# EAGLE schematic scHnRk_5 (EAGLE 7.5.0)
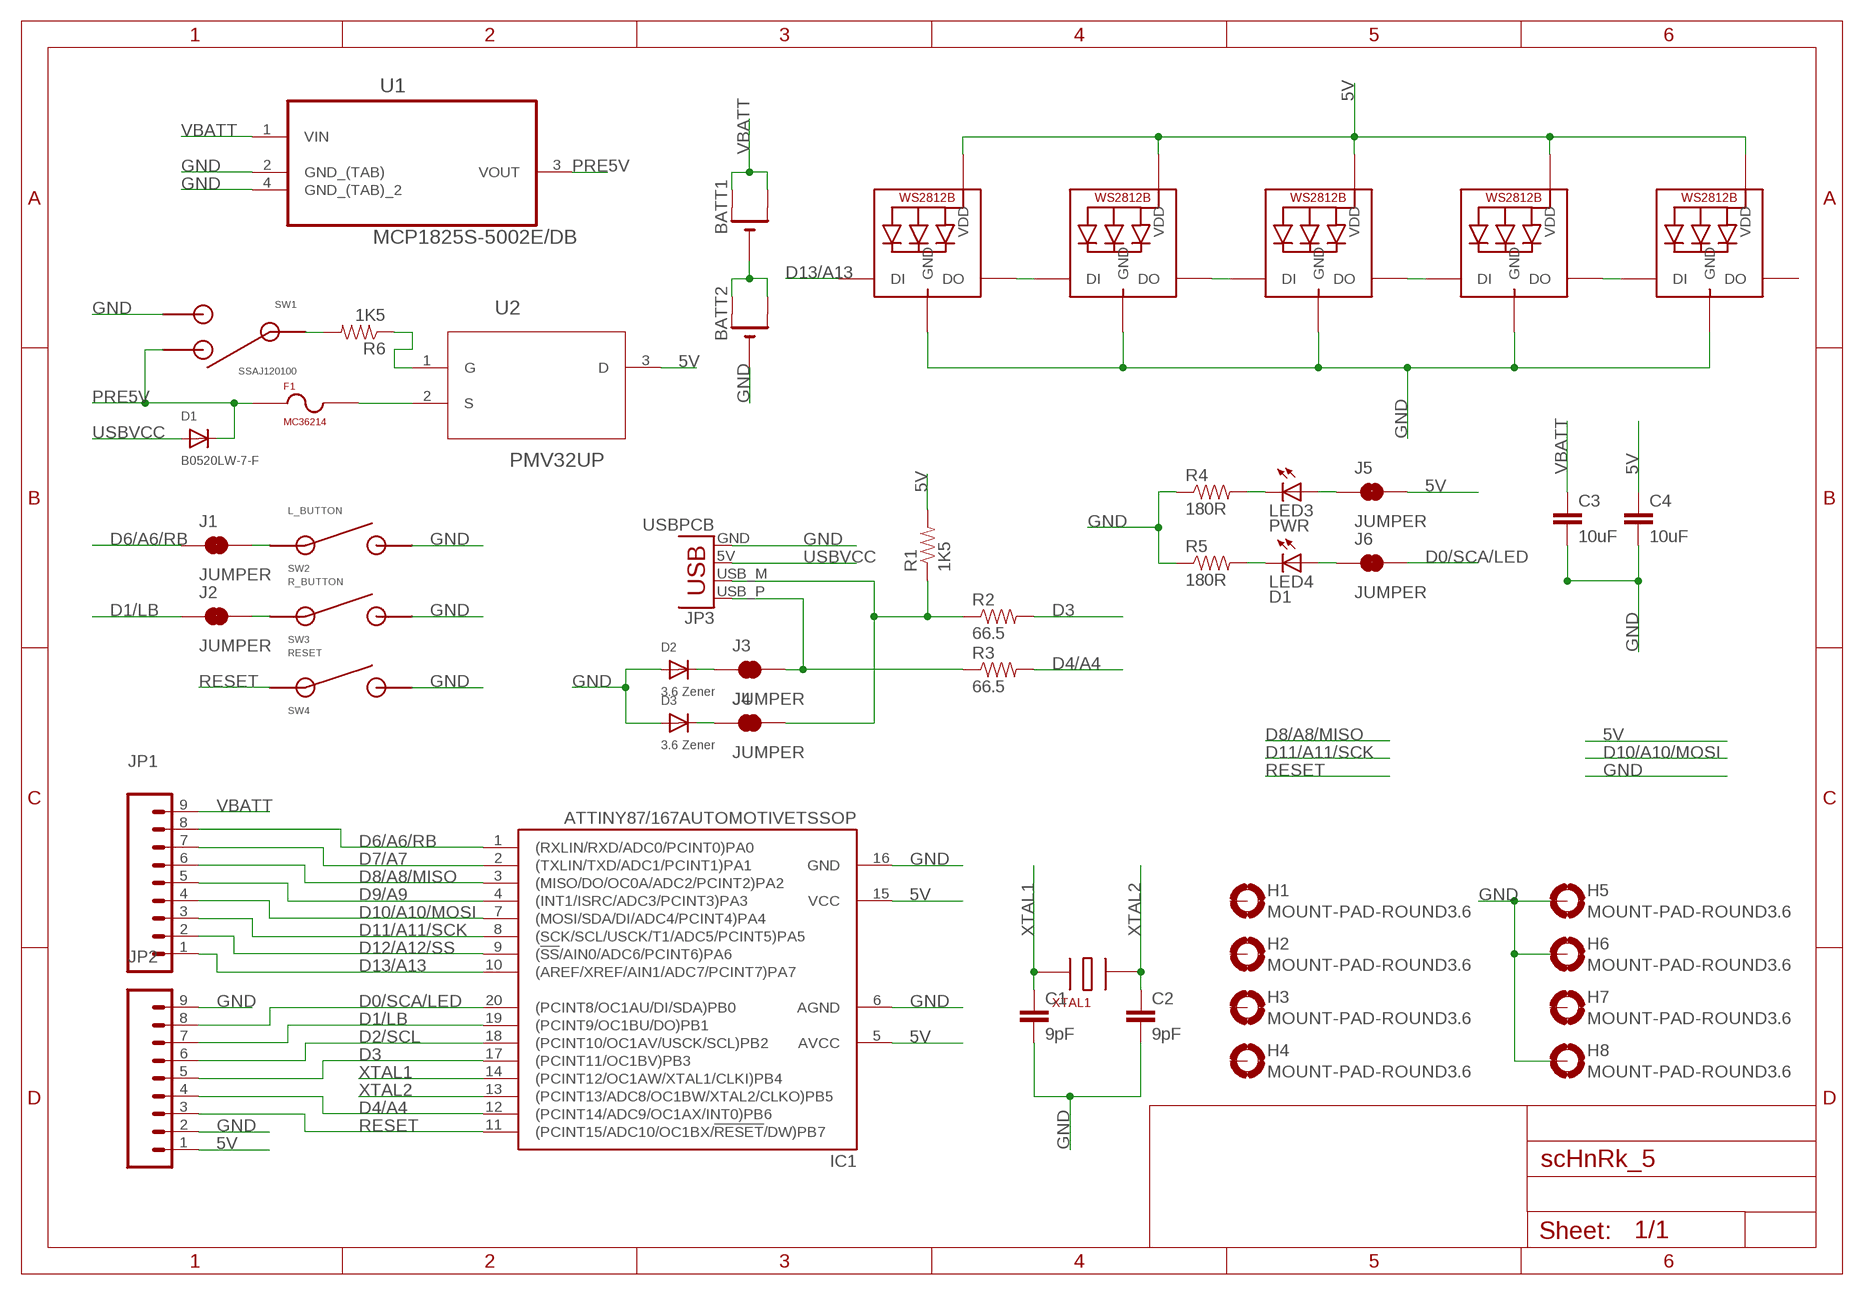
[diagram p0: schematic, sheet 1]

## Parts
BATT1  CR2032SMT  [CR2032-SMD]
BATT2  CR2032SMT  [CR2032-SMD]
C1  9pF  CAP0603-CAP  [0603-CAP]
C2  9pF  CAP0603-CAP  [0603-CAP]
C3  10uF  CAP0805  [0805]
C4  10uF  CAP0805  [0805]
D1  B0520LW-7-F  DIODESOD-123  [SOD-123]
D2  3.6 Zener  DIODESOD-523  [SOD-523]
D3  3.6 Zener  DIODESOD-523  [SOD-523]
F1  MC36214  [MC36214]
H1  MOUNT-PAD-ROUND3.6  [3,6-PAD]
H2  MOUNT-PAD-ROUND3.6  [3,6-PAD]
H3  MOUNT-PAD-ROUND3.6  [3,6-PAD]
H4  MOUNT-PAD-ROUND3.6  [3,6-PAD]
H5  MOUNT-PAD-ROUND3.6  [3,6-PAD]
H6  MOUNT-PAD-ROUND3.6  [3,6-PAD]
H7  MOUNT-PAD-ROUND3.6  [3,6-PAD]
H8  MOUNT-PAD-ROUND3.6  [3,6-PAD]
IC1  ATTINY87/167AUTOMOTIVETSSOP  [TSSOP20]
J1  JUMPER  JUMPER-PAD-2-NC_BY_TRACE  [PAD-JUMPER-2-NC_BY_TRACE_YES_SILK]
J2  JUMPER  JUMPER-PAD-2-NC_BY_TRACE  [PAD-JUMPER-2-NC_BY_TRACE_YES_SILK]
J3  JUMPER  JUMPER-PAD-2-NC_BY_TRACE  [PAD-JUMPER-2-NC_BY_TRACE_YES_SILK]
J4  JUMPER  JUMPER-PAD-2-NC_BY_TRACE  [PAD-JUMPER-2-NC_BY_TRACE_YES_SILK]
J5  JUMPER  JUMPER-PAD-2-NC_BY_TRACE  [PAD-JUMPER-2-NC_BY_TRACE_YES_SILK]
J6  JUMPER  JUMPER-PAD-2-NC_BY_TRACE  [PAD-JUMPER-2-NC_BY_TRACE_YES_SILK]
JP1  M09  [1X09]
JP2  M09  [1X09]
JP3  USBPCB  [USB-A-PCB]
LED1  WS2812B5050  [WS2812B]
LED2  WS2812B5050  [WS2812B]
LED3  PWR  LEDCHIPLED_0603  [CHIPLED_0603]
LED4  D1  LEDCHIPLED_0603  [CHIPLED_0603]
LED5  WS2812B5050  [WS2812B]
LED6  WS2812B5050  [WS2812B]
LED7  WS2812B5050  [WS2812B]
R1  1K5  RESISTOR0805-RES  [0805]
R2  66.5  RESISTOR0603-RES  [0603-RES]
R3  66.5  RESISTOR0603-RES  [0603-RES]
R4  180R  RESISTOR0805-RES  [0805]
R5  180R  RESISTOR0805-RES  [0805]
R6  1K5  RESISTOR0805-RES  [0805]
SW1  SSAJ120100  [SSAJ120100]
SW2  L_BUTTON  SKRBAGE010  [SKRBAGE010]
SW3  R_BUTTON  SKRBAGE010  [SKRBAGE010]
SW4  RESET  SKRBAGE010  [SKRBAGE010]
U1  MCP1825S-5002E/DB  [SOT230P700X180-4N]
U2  PMV32UP  [SOT95P230X110-3N]
XTAL1  16MHZ-2467444  [16MHZ-2467444]

## Nets
5V: C4.1 IC1.5(AVCC) IC1.15(VCC) J5.2 JP2.1 LED1.1-VDD(VDD) LED2.1-VDD(VDD) LED5.1-VDD(VDD) LED6.1-VDD(VDD) LED7.1-VDD(VDD) R1.2 U2.3(D)
D0/SCA/LED: IC1.20((PCINT8/OC1AU/DI/SDA)PB0) J6.2 JP2.8
D1/LB: IC1.19((PCINT9/OC1BU/DO)PB1) J2.1 JP2.7
D2/SCL: IC1.18((PCINT10/OC1AV/USCK/SCL)PB2) JP2.6
D3: IC1.17((PCINT11/OC1BV)PB3) JP2.5 R2.2
D4/A4: IC1.12((PCINT14/ADC9/OC1AX/INT0)PB6) JP2.4 R3.2
D6/A6/RB: IC1.1((RXLIN/RXD/ADC0/PCINT0)PA0) J1.1 JP1.8
D7/A7: IC1.2((TXLIN/TXD/ADC1/PCINT1)PA1) JP1.7
D8/A8/MISO: IC1.3((MISO/DO/OC0A/ADC2/PCINT2)PA2) JP1.6
D9/A9: IC1.4((INT1/ISRC/ADC3/PCINT3)PA3) JP1.5
D10/A10/MOSI: IC1.7((MOSI/SDA/DI/ADC4/PCINT4)PA4) JP1.4
D11/A11/SCK: IC1.8((SCK/SCL/USCK/T1/ADC5/PCINT5)PA5) JP1.3
D12/A12/SS: IC1.9((!SS!/AIN0/ADC6/PCINT6)PA6) JP1.2
D13/A13: IC1.10((AREF/XREF/AIN1/ADC7/PCINT7)PA7) JP1.1 LED1.4-DIN(DI)
GND: BATT2.- C1.2 C2.2 C3.2 C4.2 D2.A D3.A H5.B3,6(MOUNT) H6.B3,6(MOUNT) H8.B3,6(MOUNT) IC1.6(AGND) IC1.16(GND) JP2.2 JP2.9 JP3.GND LED1.3-GND(GND) LED2.3-GND(GND) LED5.3-GND(GND) LED6.3-GND(GND) LED7.3-GND(GND) R4.1 R5.1 SW1.P$2 SW2.P$2 SW2.P$4 SW3.P$2 SW3.P$4 SW4.P$2 SW4.P$4 U1.2(GND_(TAB)) U1.4(GND_(TAB)_2)
N$1: BATT1.- BATT2.+$1(+) BATT2.+$2(+1)
N$2: J1.2 SW2.P$1 SW2.P$3
N$3: LED1.2-DOUT(DO) LED2.4-DIN(DI)
N$4: LED2.2-DOUT(DO) LED5.4-DIN(DI)
N$5: LED5.2-DOUT(DO) LED6.4-DIN(DI)
N$6: LED6.2-DOUT(DO) LED7.4-DIN(DI)
N$7: R6.2 SW1.P$C
N$8: J2.2 SW3.P$1 SW3.P$3
N$9: D2.K(C) J3.1
N$10: D3.K(C) J4.1
N$15: J4.2 JP3.USB_M(D-) R1.1 R2.1
N$16: J3.2 JP3.USB_P(D+) R3.1
N$20: R6.1 U2.1(G)
N$22: F1.P$2 U2.2(S)
N$28: LED3.C R4.2
N$29: LED4.C R5.2
N$31: J5.1 LED3.A
N$34: J6.1 LED4.A
PRE5V: D1.C F1.P$1 SW1.P$1 U1.3(VOUT)
RESET: IC1.11((PCINT15/ADC10/OC1BX/!RESET!/DW)PB7) JP2.3 SW4.P$1 SW4.P$3
USBVCC: D1.A JP3.5V(VBUS)
VBATT: BATT1.+$1(+) BATT1.+$2(+1) C3.1 JP1.9 U1.1(VIN)
XTAL1: C1.1 IC1.14((PCINT12/OC1AW/XTAL1/CLKI)PB4) XTAL1.P$1
XTAL2: C2.1 IC1.13((PCINT13/ADC8/OC1BW/XTAL2/CLKO)PB5) XTAL1.P$3
Unconnected: H1.B3,6(MOUNT) H2.B3,6(MOUNT) H3.B3,6(MOUNT) H4.B3,6(MOUNT) H7.B3,6(MOUNT) LED7.2-DOUT(DO)

## Library data of the parts
BATT1 BATT2 = adafruit:CR2032
C1-C4 = SparkFun-Passives:CAP: Capacitor Standard 0603 ceramic capacitor, and 0.1" leaded capacitor.
D1-D3 = adafruit:DIODE: Diode SMADIODE - SMA Surface Mount Package 20V 1A Schottky Diode Digikey: 641-1014-6-ND DO-1N4148 - Through Hole Small Current Diode SOD-123 20V 1 A (.5mV Vf) Schottky Diode - Digikey: MBRX120TPMSCT-ND SOD-323 10V 570mA (.38mV Vf, 3ns) Schottky Diode - Digikey: ZLLS410CT-ND SOD-523 30V 30mA Schottky Diode (RB751S-40TE61) - Digikey: RB751S-40TE61CT-ND SOT23-R/W - SOT23 Package (R = Solder Paste/Reflow Ovens, W = Hand-Soldering) BAT54Film 40V 300mA - Digikey: 497-7162-1-ND
F1 = scHnRk:MC36214
H1-H8 = holes:MOUNT-PAD-ROUND: MOUNTING PAD, round
IC1 = attiny87_167_automotive:ATTINY87/167AUTOMOTIVE
J1-J6 = SparkFun-Passives:JUMPER-PAD-2-NC_BY_TRACE
JP1 JP2 = SparkFun-Connectors:M09: Header 9 Standard 9-pin 0.1" header. Use with straight break away headers (SKU : PRT-00116), right angle break away headers (PRT-00553), swiss pins (PRT-00743), machine pins (PRT-00117), and female headers (PRT-00115).
JP3 = SparkFun-Connectors:USB: USB Connectors USB-B-PTH is fully proven SKU : PRT-00139/CONN-08278 USB-miniB is fully proven SKU : PRT-00587 USB-A-PCB is untested. USB-A-H is throughly reviewed, but untested. Spark Fun Electronics SKU : PRT-00437 USB-B-SMT is throughly reviewed, but untested. Needs silkscreen touching up. USB-A-S has not been used/tested USB-MB-H has not been used/tested USB-MICROB has been used. CONN-09505
LED1 LED2 LED5-LED7 = adafruit:WS2812B
LED3 LED4 = adafruit:LED: LED OSRAM: - CHIPLED LG R971, LG N971, LY N971, LG Q971, LY Q971, LO R971, LY R971 LH N974, LH R974 LS Q976, LO Q976, LY Q976 LO Q996 - Hyper CHIPLED LW Q18S LB Q993, LB Q99A, LB R99A - SideLED LS A670, LO A670, LY A670, LG A670, LP A670 LB A673, LV A673, LT A673, LW A673 LH A674 LY A675 LS A676, LA A676, LO A676, LY A676, LW A676 LS A679, LY A679, LG A679 - Hyper Micro SIDELED® LS Y876, LA Y876, LO Y876, LY Y876 LT Y87S - SmartLED LW L88C, LW L88S LB L89C, LB L89S, LG L890 LS L89K, LO L89K, LY L89K LS L896, LA L896, LO L896, LY L896 - TOPLED LS T670, LO T670, LY T670, LG T670, LP T670 LSG T670, LSP T670, LSY T670, LOP T670, LYG T670 LG T671, LOG T671, LSG T671 LB T673, LV T673, LT T673, LW T673 LH T674 LS T676, LA T676, LO T676, LY T676, LB T676, LH T676, LSB T676, LW T676 LB T67C, LV T67C, LT T67C, LS T67K, LO T67K, LY T67K, LW E67C LS E67B, LA E67B, LO E67B, LY E67B, LB E67C, LV E67C, LT E67C LW T67C LS T679, LY T679, LG T679 LS T770, LO T770, LY T770, LG T770, LP T770 LB T773, LV T773, LT T773, LW T773 LH T774 LS E675, LA E675, LY E675, LS T675 LS T776, LA T776, LO T776, LY T776, LB T776 LHGB T686 LT T68C, LB T68C - Hyper Mini TOPLED® LB M676 - Mini TOPLED Santana® LG M470 LS M47K, LO M47K, LY M47K Source: http://www.osram.convergy.de/
R1-R6 = SparkFun-Passives:RESISTOR: Resistor Basic schematic elements and footprints for 0603, 1206, and PTH resistors.
SW1 = scHnRk:SSAJ120100
SW2-SW4 = scHnRk:SKRBAGE010
U1 = Microchip_By_element14_Batch_1:MCP1825S-5002E/DB: IC, LDO, 5.0V, 500MA; MPN: MCP1825S-5002E/DB; OC_FARNELL: 1578407; OC_NEWARK: 26M9964; PACKAGE: SOT-223-3; SUPPLIER: Microchip
U2 = NXP_By_element14_Batch_1:PMV32UP: P-channel Trench MOSFET; MPN: PMV32UP; OC_FARNELL: 1894624; OC_NEWARK: 47T2356; PACKAGE: SOT-3; SUPPLIER: NXP Semiconductors
XTAL1 = scHnRk:16MHZ-2467444

## Net classes
0 default: clearance 0.305 mm